# Altium project DashDAP.PrjPcb
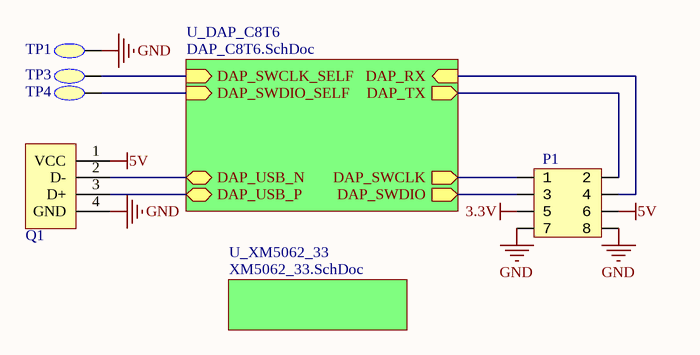
[diagram p0: DashDAP.SchDoc]
2 sheets, 9 parts. Net scope: hierarchical (ports join the sheet entries above them; power ports are global).
Board file: PCB1.PcbDoc
Sheets:
  DashDAP.SchDoc
    U_XM5062_33 = XM5062_33.SchDoc

## Sheet DashDAP.SchDoc
size 292 x 193 mm; Author: Power Lin; Revision: 0.1; SheetNumber: 1; SheetTotal: 1; Website: wiki-power.com

### Parts
P1  HDR2x4_2.54  [HDR2X4_2.54_180H]  (value not drawn)
Q1  USB A  [USB-A-male]  (value not drawn)
TP1  TestPoint  [TestPoint]  (value not drawn)
TP3  TestPoint  [TestPoint]  (value not drawn)
TP4  TestPoint  [TestPoint]  (value not drawn)

### Sub-sheets
U_DAP_C8T6 = DAP_C8T6.SchDoc (file not in this document): DAP_SWCLK_SELF (in), DAP_SWDIO_SELF (in), DAP_SWCLK (out), DAP_SWDIO (out), DAP_TX (out), DAP_RX (in), DAP_USB_N (bidir), DAP_USB_P (bidir)
U_XM5062_33 = XM5062_33.SchDoc: no entries

### Nets
3.3V: P1.5
5V: P1.6 Q1.1(VCC)
GND: P1.7 P1.8 Q1.4(GND) TP1.1
NetP1_1: P1.1 ; sheet U_DAP_C8T6/DAP_SWCLK
NetP1_2: P1.2 ; sheet U_DAP_C8T6/DAP_TX
NetP1_3: P1.3 ; sheet U_DAP_C8T6/DAP_SWDIO
NetP1_4: P1.4 ; sheet U_DAP_C8T6/DAP_RX
NetQ1_2: Q1.2(D-) ; sheet U_DAP_C8T6/DAP_USB_N
NetQ1_3: Q1.3(D+) ; sheet U_DAP_C8T6/DAP_USB_P
NetTP3_1: TP3.1 ; sheet U_DAP_C8T6/DAP_SWCLK_SELF
NetTP4_1: TP4.1 ; sheet U_DAP_C8T6/DAP_SWDIO_SELF

### Notes on the sheet
- Author
- DocumentName
- ModifiedDate
- ProjectName
- SheetNumber
- SheetTotal
- Website
- Revision

### Library data of the parts
P1 = HDR2x4_2.54: Header
Q1 = USB A: USB 接口
TP1 TP3 TP4 = TestPoint: 测试点

## Sheet XM5062_33.SchDoc
size 292 x 193 mm; Author: Power Lin; SheetNumber: 1; SheetTotal: 1; Website: wiki-power.com
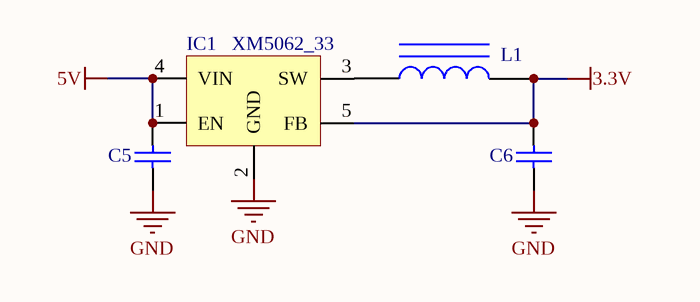
[diagram p1: XM5062_33.SchDoc]

### Parts
C5  4.7uF  [CAP-0603]  (value not drawn)
C6  10uF  [CAP-0603]  (value not drawn)
IC1  XM5062_33  [SOT-23-5]
L1  2.2uH  [XAL6060-103MEB]  (value not drawn)

### Nets
3.3V: C6.2 IC1.5(FB) L1.2
5V: C5.2 IC1.1(EN) IC1.4(VIN)
GND: C5.1 C6.1 IC1.2(GND)
NetIC1_3: IC1.3(SW) L1.1

### Notes on the sheet
- Author
- DocumentName
- ModifiedDate
- ProjectName
- SheetNumber
- SheetTotal
- Website
- Revision

### Library data of the parts
C5 C6 = CAP: 贴片电容; ComponentLink1Description: 供应商链接; ComponentLink1URL: http://www.szlcsc.com/product/details_53938.html; Package: 0402; Supplier: LC; SuppliersPartNumber: C52923
IC1 = XM5062: 降压转换芯片; Manufacturer_Name: TE Connectivity; Manufacturer_Part_Number: 1-1393258-5; Datasheet Link: http://www.te.com/commerce/DocumentDelivery/DDEController?Action=showdoc&DocId=Data+Sheet%7FSR2M%7F1116%7Fpdf%7FEnglish%7FENG_DS_SR2M_1116.pdf%7F1-1393258-5; Height: 25mm
L1 = INDUCTOR: 贴片电感; ComponentLink1Description: 供应商链接; ComponentLink1URL: http://www.szlcsc.com/product/details_33003.html; Package: 0402; Supplier: LC; SuppliersPartNumber: C32041

## Nets that join several sheets
3.3V: DashDAP (P1.5), XM5062_33 (C6.2 IC1.5 L1.2)
5V: DashDAP (P1.6 Q1.1), XM5062_33 (C5.2 IC1.1 IC1.4)
GND: DashDAP (P1.7 P1.8 Q1.4 TP1.1), XM5062_33 (C5.1 C6.1 IC1.2)